# EAGLE design versao4.0 (EAGLE 7.7.0)
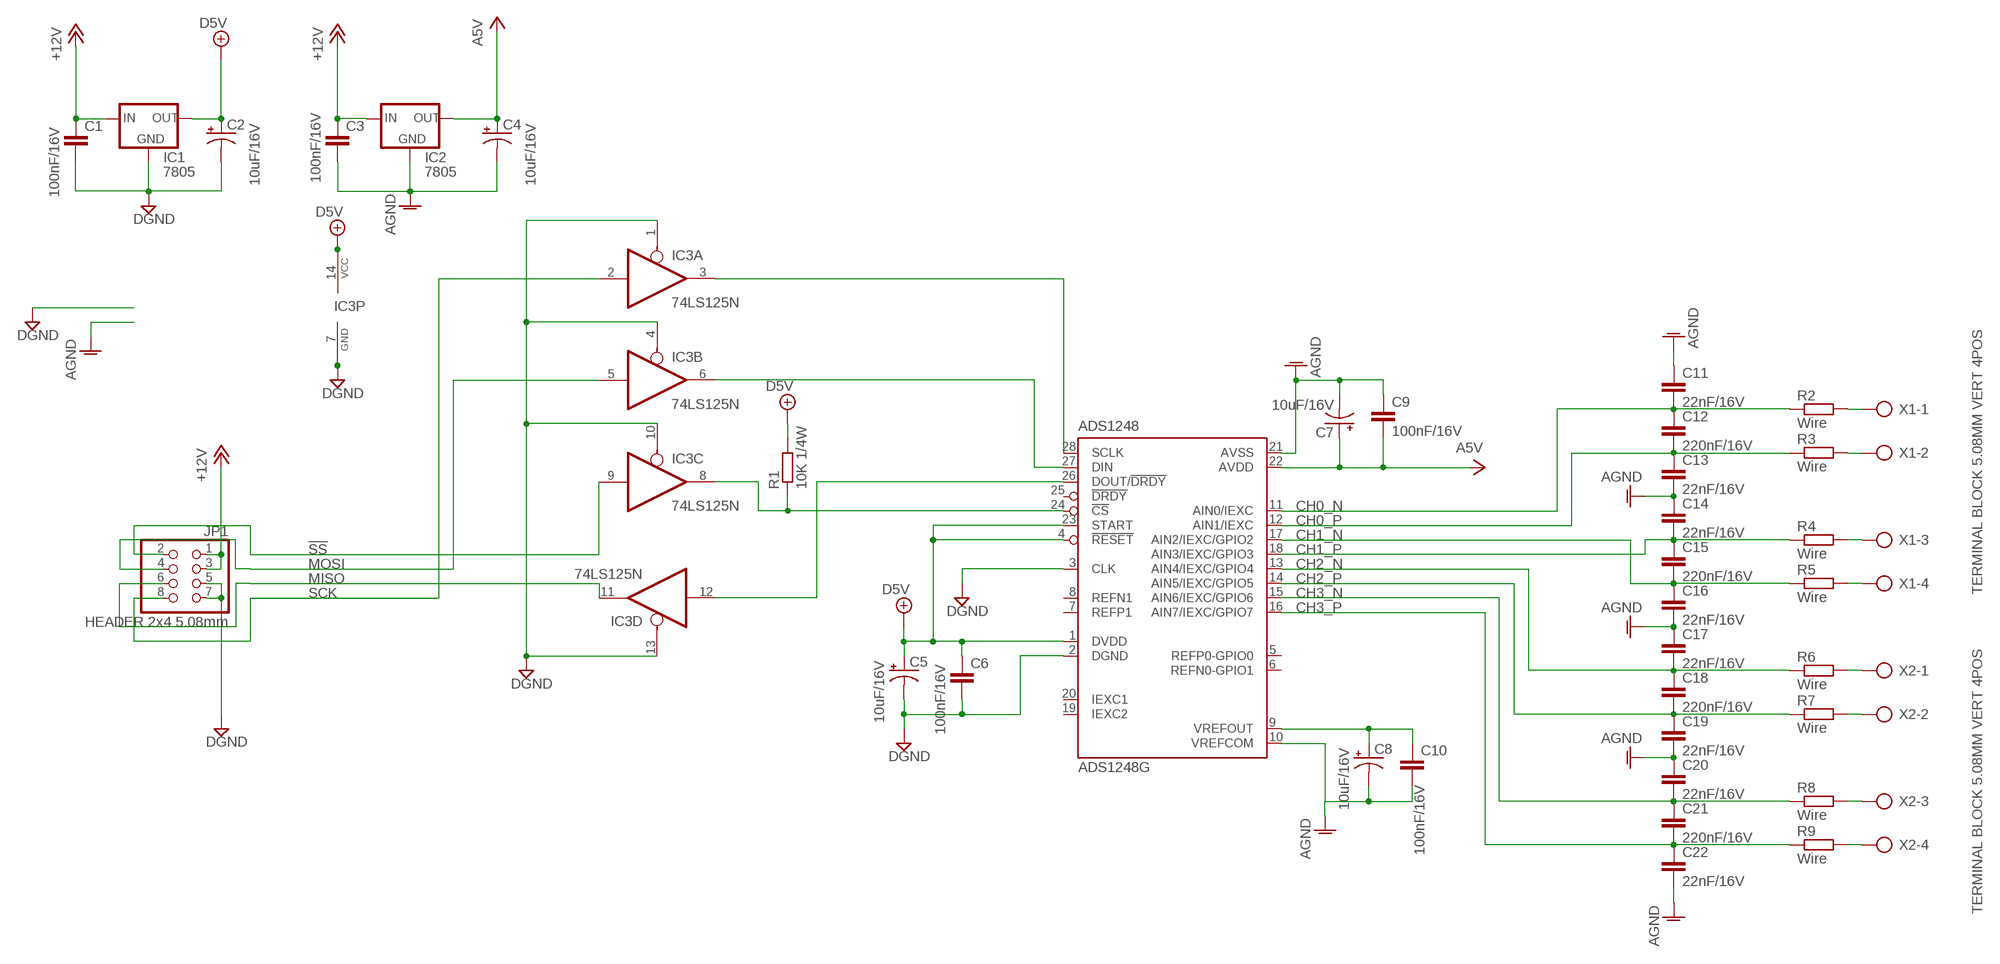
[diagram p0: schematic, sheet 1]

## Parts
C1  100nF/16V  C5/3  [C5B3]
C2  10uF/16V  CPOL-USE2-5  [E2-5]
C3  100nF/16V  C5/3  [C5B3]
C4  10uF/16V  CPOL-USE2-5  [E2-5]
C5  10uF/16V  CPOL-USE2-5  [E2-5]
C6  100nF/16V  C5/3  [C5B3]
C7  10uF/16V  CPOL-USE2-5  [E2-5]
C8  10uF/16V  CPOL-USE2-5  [E2-5]
C9  100nF/16V  C5/3  [C5B3]
C10  100nF/16V  C5/3  [C5B3]
C11  22nF/16V  C5/2.5  [C5B2.5]
C12  220nF/16V  C5/2.5  [C5B2.5]
C13  22nF/16V  C5/2.5  [C5B2.5]
C14  22nF/16V  C5/2.5  [C5B2.5]
C15  220nF/16V  C5/2.5  [C5B2.5]
C16  22nF/16V  C5/2.5  [C5B2.5]
C17  22nF/16V  C5/2.5  [C5B2.5]
C18  220nF/16V  C5/2.5  [C5B2.5]
C19  22nF/16V  C5/3  [C5B3]
C20  22nF/16V  C5/2.5  [C5B2.5]
C21  220nF/16V  C5/2.5  [C5B2.5]
C22  22nF/16V  C5/2.5  [C5B2.5]
IC1  7805  78XXL  [78XXL]
IC2  7805  78XXL  [78XXL]
IC3  74LS125N  [DIL14]
IC4  ADS1248G  [P-TSSOP28-1]
JP1  HEADER 2x4 5.08mm  PINHD-2X4  [2X04]
R1  10K 1/4W  R-EU_0204/7  [0204/7]
R2  Wire  R-EU_0204/7  [0204/7]
R3  Wire  R-EU_0204/7  [0204/7]
R4  Wire  R-EU_0204/7  [0204/7]
R5  Wire  R-EU_0204/7  [0204/7]
R6  Wire  R-EU_0204/7  [0204/7]
R7  Wire  R-EU_0204/7  [0204/7]
R8  Wire  R-EU_0204/7  [0204/7]
R9  Wire  R-EU_0204/7  [0204/7]
X1  TERMINAL BLOCK 5.08MM VERT 4POS  AK500/4-H  [AK500/4-H]
X2  TERMINAL BLOCK 5.08MM VERT 4POS  AK500/4-H  [AK500/4-H]

## Nets
!SS: IC3.9(C:I) JP1.2
+12V: C1.1 C3.1 IC1.IN IC2.IN JP1.1 JP1.3
A5V: C4.+ C7.+ C9.2 IC2.OUT IC4.22(AVDD)
AGND: C3.2 C4.- C7.- C8.- C9.1 C10.2 C11.1 C13.2 C14.1 C16.2 C17.1 C19.2 C20.1 C22.2 IC2.GND IC4.10(VREFCOM) IC4.21(AVSS)
CH0_N: C11.2 C12.1 IC4.11(AIN0/IEXC) R2.1
CH0_P: C12.2 C13.1 IC4.12(AIN1/IEXC) R3.1
CH1_N: C15.2 C16.1 IC4.17(AIN2/IEXC/GPIO2) R5.1
CH1_P: C14.2 C15.1 IC4.18(AIN3/IEXC/GPIO3) R4.1
CH2_N: C17.2 C18.1 IC4.13(AIN4/IEXC/GPIO4) R6.1
CH2_P: C18.2 C19.1 IC4.14(AIN5/IEXC/GPIO5) R7.1
CH3_N: C20.2 C21.1 IC4.15(AIN6/IEXC/GPIO6) R8.1
CH3_P: C21.2 C22.1 IC4.16(AIN7/IEXC/GPIO7) R9.1
D5V: C2.+ C5.+ C6.1 IC1.OUT IC3.14(P:VCC) IC4.1(DVDD) IC4.4(!RESET) IC4.23(START) R1.2
DGND: C1.2 C2.- C5.- C6.2 IC1.GND IC3.1(A:OE) IC3.4(B:OE) IC3.7(P:GND) IC3.10(C:OE) IC3.13(D:OE) IC4.2(DGND) IC4.3(CLK) JP1.5 JP1.7
MISO: IC3.11(D:O) JP1.6
MOSI: IC3.5(B:I) JP1.4
N$1: C8.+ C10.1 IC4.9(VREFOUT)
N$4: R3.2 X1.2
N$5: IC3.3(A:O) IC4.28(SCLK)
N$6: R9.2 X2.4
N$11: IC3.6(B:O) IC4.27(DIN)
N$12: IC3.12(D:I) IC4.26(DOUT/!DRDY)
N$13: IC3.8(C:O) IC4.24(!CS) R1.1
N$15: R2.2 X1.1
N$16: R8.2 X2.3
N$17: R7.2 X2.2
N$18: R6.2 X2.1
N$19: R5.2 X1.4
N$20: R4.2 X1.3
SCK: IC3.2(A:I) JP1.8
Unconnected: IC4.5(REFP0-GPIO0) IC4.6(REFN0-GPIO1) IC4.7(REFP1) IC4.8(REFN1) IC4.19(IEXC2) IC4.20(IEXC1) IC4.25(!DRDY)

## Library data of the parts
C1 C3 C6 C9-C22 = capacitor-wima:C: CAPACITOR naming: grid - package width
C2 C4 C5 C7 C8 = resistor:CPOL-US: POLARIZED CAPACITOR, American symbol
IC1 IC2 = v-reg:78XXL: VOLTAGE REGULATOR
IC3 = 74xx-us:74*125: Quad bus BUFFER, 3-state
IC4 = mylib:ADS1248: Phase locked loop (PLL), with a multistandard video modulator and a programmable sound FM and AM modulator
JP1 = pinhead:PINHD-2X4: PIN HEADER
R1-R9 = resistor:R-EU_: RESISTOR, European symbol
X1 X2 = con-ptr500:AK500/4-H: CONNECTOR Aug. 2004 / PTR Meßtechnik: Die Bezeichnung der Serie AK505 wurde geändert. Es handelt sich hierbei um AK500 in horizontaler Ausführung.; OC_FARNELL: unknown; OC_NEWARK: unknown

## Board
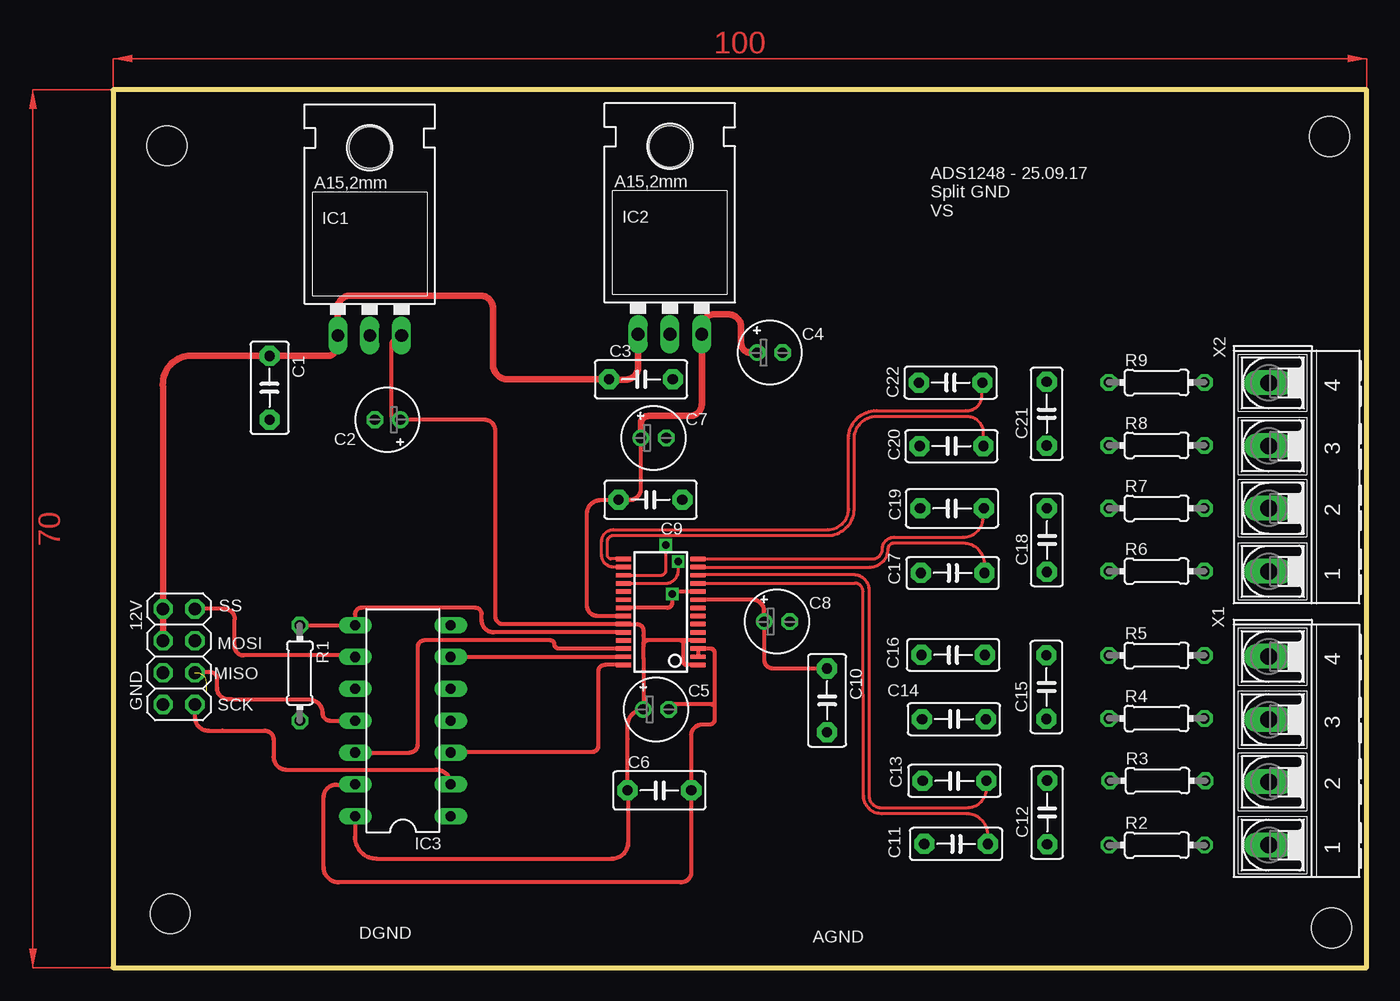
[diagram p1: board, top side]
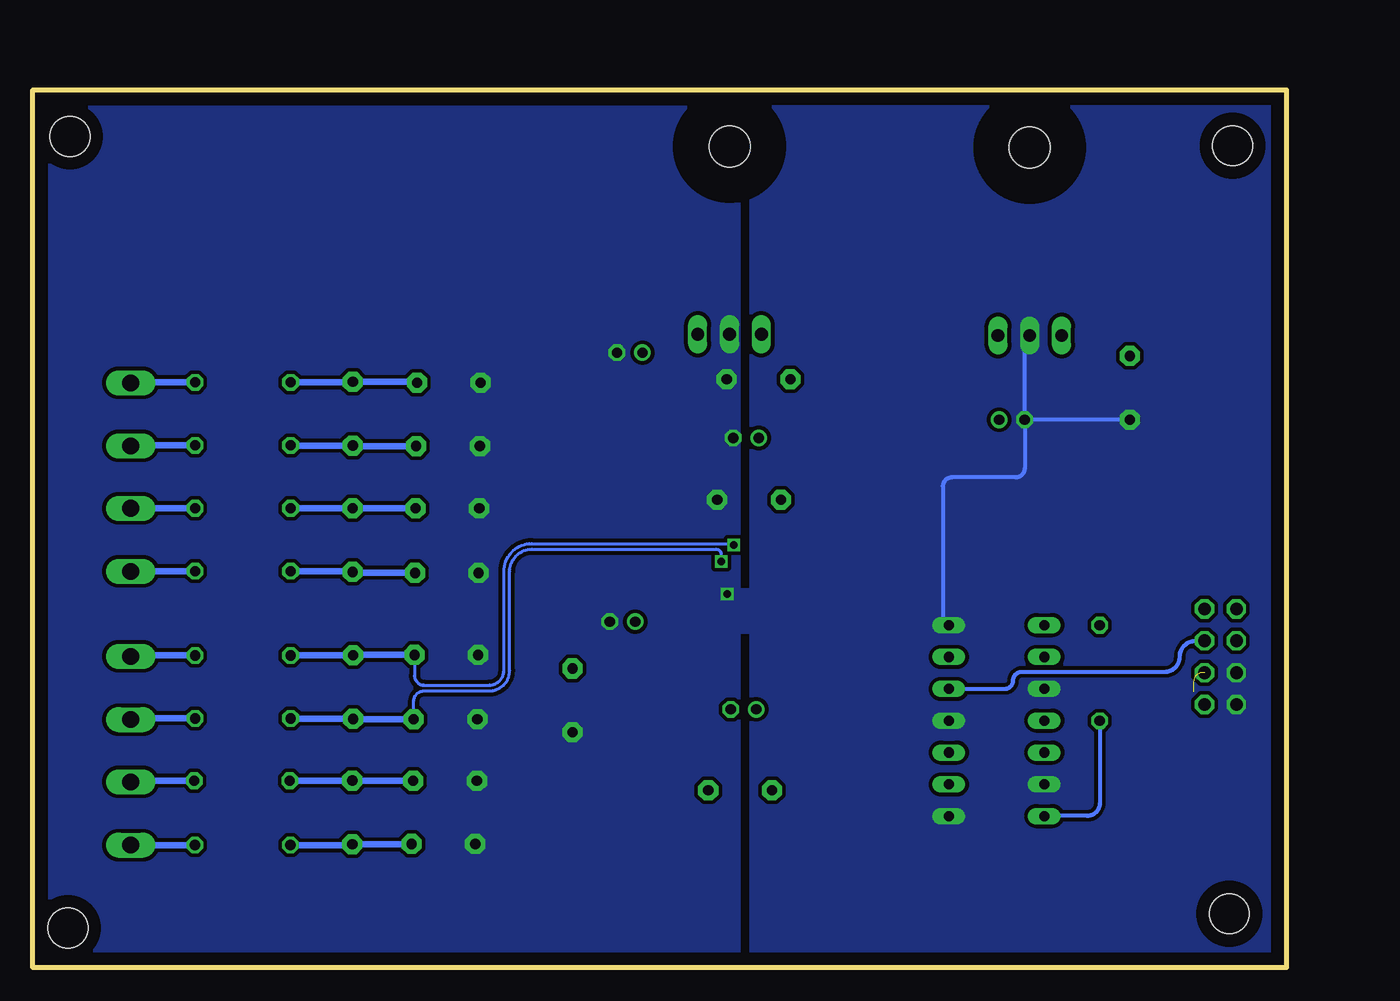
[diagram p2: board, bottom side, seen from below]

Size 100 x 70 mm. Coordinates in mm from the lower left corner, seen from the top.
Outline: 0,0 100,0 100,70 0,70 0,0
Copper layers (1*16): Top 0.035mm / dielectric 1.5mm / Bottom 0.035mm
Design rules "default": minimum track width 10mil, minimum drill 24mil, track to track 8mil, track to pad 8mil, pad to pad 8mil, via to via 8mil, smd to smd 8mil, copper to edge 40mil, drill to drill 8mil, minimum pad ring 10mil, minimum via ring 8mil, stop-mask expansion 4mil, vias tented up to drill 0mil, thermal gap 10mil
Holes 3.2 mm at 97.05,66.3 4.55,4.3 4.3,65.55 97.2,3.15

### Footprints (pad centres in the part's own frame; a part is rotated, then mirrored left to right if it is on the bottom)
C5B3 = drill 0.813 pad 1.6 octagon: 1 -2.54,0; 2 2.54,0
E2-5 = drill 0.813 pad 1.27: + -1.016,0 | drill 0.813 pad 1.27 octagon: - 1.016,0
C5B2.5 = drill 0.813 pad 1.6 octagon: 1 -2.54,0; 2 2.54,0
78XXL = drill 1.016 long: GND 0,-3.81; IN -2.54,-3.81; OUT 2.54,-3.81 | hole 3.302: 0,11.176
DIL14 = drill 0.813 long: 1 -7.62,-3.81; 2 -5.08,-3.81; 3 -2.54,-3.81; 4 0,-3.81; 5 2.54,-3.81; 6 5.08,-3.81; 7 7.62,-3.81; 8 7.62,3.81; 9 5.08,3.81; 10 2.54,3.81; 11 0,3.81; 12 -2.54,3.81; 13 -5.08,3.81; 14 -7.62,3.81
P-TSSOP28-1 = smd 0.35 x 1.2: 1 -4.225,-2.975; 2 -3.575,-2.975; 3 -2.925,-2.975; 4 -2.275,-2.975; 5 -1.625,-2.975; 6 -0.975,-2.975; 7 -0.325,-2.975; 8 0.325,-2.975; 9 0.975,-2.975; 10 1.625,-2.975; 11 2.275,-2.975; 12 2.925,-2.975; 13 3.575,-2.975; 14 4.225,-2.975; 15 4.225,2.975; 16 3.575,2.975; 17 2.925,2.975; 18 2.275,2.975; 19 1.625,2.975; 20 0.975,2.975; 21 0.325,2.975; 22 -0.325,2.975; 23 -0.975,2.975; 24 -1.625,2.975; 25 -2.275,2.975; 26 -2.925,2.975; 27 -3.575,2.975; 28 -4.225,2.975
2X04 = drill 1.016 octagon: 1 -3.81,-1.27; 2 -3.81,1.27; 3 -1.27,-1.27; 4 -1.27,1.27; 5 1.27,-1.27; 6 1.27,1.27; 7 3.81,-1.27; 8 3.81,1.27
0204/7 = drill 0.813 octagon: 1 -3.81,0; 2 3.81,0
AK500/4-H = drill 1.321 long: 1 -7.518,0; 2 -2.489,0; 3 2.489,0; 4 7.518,0

### Placement (x,y rotation side)
C1  12.48,46.25 270 top
C2  21.89,43.7 180 top
C3  42.11,46.93 0 top
C4  52.39,49.05 0 top
C5  43.31,20.6 0 top
C6  43.58,14.14 0 top
C7  43.11,42.25 0 top
C8  52.96,27.6 0 top
C9  42.87,37.32 180 top
C10  56.96,21.32 270 top
C11  67.25,9.87 0 top
C12  74.52,12.38 90 top
C13  67.12,14.9 180 top
C14  67.08,19.82 0 top
C15  74.46,22.38 90 top
C16  67.02,24.94 180 top
C17  66.98,31.48 0 top
C18  74.5,34.1 90 top
C19  66.93,36.63 180 top
C20  66.88,41.6 0 top
C21  74.48,44.18 90 top
C22  66.82,46.66 180 top
IC1  20.47,54.23 0 top
IC2  44.42,54.33 0 top
IC3  23.12,19.7 90 top
IC4  43.69,28.37 90 top
JP1  5.25,24.8 270 top
R1  14.89,23.5 270 top
R2  83.27,9.78 0 top
R3  83.32,14.91 0 top
R4  83.25,19.88 0 top
R5  83.25,24.9 0 top
R6  83.25,31.62 0 top
R7  83.25,36.64 0 top
R8  83.25,41.66 0 top
R9  83.25,46.68 0 top
X1  92.2,17.3 90 top
X2  92.2,39.13 90 top

### Tracks (layer width: path | path; a pad name or v marks a point on that pad's centre or on a via)
!SS
  Top 0.305: IC3.9 arc90 19.19,24.9 10.4,24.9 arc-90 9.7,25.6 9.7,27.8 arc90 8.89,28.61 JP1.2
+12V
  Top 0.5: IC2.IN 41.88,47.88 arc-90 40.9,46.9 39.6,46.9 arc-90 C3.1 31.47,46.93 arc-90 30.3,48.1 30.3,52.6 arc90 29.3,53.6 18.9,53.6 arc90 17.9,52.6 17.9,50.45 arc90 IC1.IN arc90 17.9,50.39 17.9,49.6 arc-90 17.09,48.79 C1.1 arc90 C1.1 6,48.8 arc90 3.98,46.28 JP1.1 JP1.3
A5V
  Top 0.305: IC4.22 38.66,28.05 arc-90 37.8,28.9 37.8,36.2 arc-90 38.9,37.3 40.31,37.3 arc90 C9.2 arc90 40.35,37.3 41.2,37.3 | 41.5,37.3 41.2,37.3 | C7.+ 42.09,38.19 arc-90 41.2,37.3
  Top 0.5: C4.+ 50.85,49.05 arc-90 50.1,49.8 50.1,51.1 arc90 49.1,52.1 47.9,52.1 arc90 46.96,51.16 IC2.OUT 46.96,44.96 arc-90 46,44 43.3,44 42.7,44 arc90 42.1,43.4 C7.+ arc-90 C7.+
AGND  (via drill 0.6)
  Top 0.305: IC4.10 arc-90 IC4.10 44.8,30 arc90 v44.6,29.8 44.6,29.1 arc-90 44.2,28.7 IC4.21 arc90 IC4.21
  pour Bottom (isolate 0.305, no thermals): 43.7,69.2 43.7,0.7 arc90 43.9,0.5 99.6,0.5 99.6,69.1 arc90 99.5,69.2
CH0_N
  Top 0.254: C11.2 69.79,10.58 arc90 68.1,12.27 61.3,12.27 arc-90 59.87,13.7 59.82,30 arc90 59.15,30.67 arc-90 59.17,30.64 IC4.11
  Bottom 0.5: R2.1 74.58,9.78 arc-90 C12.1 69.82,9.84 arc-90 C11.2
CH0_P
  Top 0.254: C13.1 69.66,14.29 arc-90 68.1,12.73 61.3,12.73 arc-90 60.33,13.7 60.33,30 arc90 59.2,31.33 46.83,31.33 arc-90 IC4.12
  Bottom 0.5: C13.1 74.5,14.9 arc90 C12.2 R3.1 arc-90 R3.1
CH1_N  (via drill 0.6)
  Top 0.254: IC4.17 43.7,31.3 arc90 44.1,31.7 v44.1,33.7
  Bottom 0.254: C16.1 69.56,23.29 arc-90 68.8,22.53 63.6,22.53 arc-90 62.43,23.7 62.43,31.6 arc90 60.2,33.83 44.23,33.83 arc90 v44.1,33.7 | 79.42,24.92 arc90 R5.1
  Bottom 0.5: 79.42,24.92 C15.2 arc90 74.44,24.94 C16.1
CH1_P  (via drill 0.6)
  Top 0.254: IC4.18 44.05,30.64 arc90 45.1,31.7 v45.1,32.4
  Bottom 0.254: C14.2 69.62,21.25 arc90 68.8,22.07 63.6,22.07 arc-90 61.97,23.7 61.97,31.6 arc90 60.2,33.37 45.47,33.37 arc90 45.1,33 v45.1,32.4 | R4.1 arc-90 79.4,19.84
  Bottom 0.5: 79.4,19.84 C15.1 arc-90 74.44,19.82 C14.2
CH2_N
  Top 0.254: IC4.13 60.37,31.95 arc90 61.83,33.4 arc-90 62.3,33.87 67.8,33.87 67.83,33.87 arc-90 69.5,32.2 69.5,31.5 arc90 C17.2
  Bottom 0.5: R6.1 74.56,31.62 arc90 C18.1 arc-90 74.42,31.48 C17.2
CH2_P
  Top 0.254: IC4.14 60.57,32.59 arc90 61.37,33.4 arc-90 62.3,34.33 67.8,34.33 67.83,34.33 arc90 69.4,35.9 69.4,36.56 arc-90 C19.1
  Bottom 0.5: R7.1 C18.2 arc-90 C18.2 C19.1
CH3_N
  Top 0.254: IC4.15 39.73,32.59 arc-90 39.43,32.9 39.43,34 arc-90 39.9,34.47 57,34.47 arc90 59.13,36.6 59.13,42.2 arc-90 60.9,43.97 68,43.97 68.13,43.97 arc-90 69.4,42.7 69.4,41.62 arc90 C20.2
  Bottom 0.5: C20.2 74.44,41.6 arc90 C21.1 79.42,41.64 arc90 R8.1
CH3_P
  Top 0.254: IC4.16 39.93,31.95 arc-90 38.97,32.9 38.97,34 arc-90 39.9,34.93 57,34.93 arc90 58.67,36.6 58.67,42.2 arc-90 60.9,44.43 68,44.43 68.13,44.43 arc90 69.3,45.6 69.3,46.6 arc-90 C22.1
  Bottom 0.5: R9.1 74.52,46.68 arc-90 C21.2 69.42,46.72 arc90 C22.1
D5V  (via drill 0.61)
  Top 0.254: 42.8,26.1 42.7,26.1 arc-90 42.3,26.5 | 42.9,26.1 42.8,26.1 | 42.8,26.1 arc90 42.3,25.6 | 45.5,25.7 45.5,25.8 arc-90 45.8,26.1 | 45.5,25.7 45.5,25.6 45.5,25.7 | 45.5,25.7 arc90 45.1,26.1 | 45.5,25.7 arc-90 45.9,26.1
  Top 0.305: IC1.OUT arc90 22.2,49.61 22.2,44 arc90 22.5,43.7 C2.+ 29.6,43.7 arc-90 30.5,42.8 30.5,28 arc90 31.11,27.39 IC4.23 41.8,27.39 arc-90 42.3,26.9 42.3,26.5 42.3,25.8 | 42.3,25.8 42.3,25.6 42.3,24.7 C5.+ arc-90 C5.+ arc90 41.04,19.3 41.04,18.24 C6.1 arc-90 41.1,14.08 41.1,10 arc-90 39.8,8.7 21,8.7 arc-90 19.29,10.41 v19.29,12.1 | IC4.4 45.6,26.09 | 45.6,26.09 42.59,26.09 arc90 42.3,25.8 | IC4.1 45.76,24.14 arc-90 45.5,24.4 45.5,25.6 45.5,25.7 45.5,26 arc-90 45.6,26.09
  Bottom 0.305: R1.2 14.89,13.11 arc90 15.9,12.1 v19.29,12.1 arc-90 IC3.14
DGND
  Top 0.254: 47.5,21 47.6,21 | 47.6,21 arc-90 48,20.6 | 47.6,21 arc90 48,21.4
  Top 0.305: IC4.2 IC4.3 arc-90 IC4.3 47.65,25.45 arc-90 48,25.1 48,21.4 48,21.2 | 48,21.2 48,20.6 48,19.8 arc-90 47.6,19.4 47,19.4 arc90 46.12,18.52 C6.2 46.12,7.62 arc-90 45.3,6.8 18,6.8 arc-90 16.8,8 16.8,13.6 arc-90 17.8,14.6 19.29,14.6 arc90 IC3.13 | 48,21.2 arc-90 47.78,20.98 arc90 47.75,21 45.8,21 44.78,21 arc90 C5.-
  Bottom 0.305: C2.- 20.87,39.83 arc90 21.6,39.1 26.7,39.1 arc-90 27.4,38.4 27.4,27.79 arc-90 IC3.7 | C2.- 20.87,50.02 arc90 IC1.GND | C1.2 C2.- arc-90 C2.-
  pour Bottom (isolate 0.305, no thermals): 0.2,69.5 42.7,69.3 42.7,0.4 0.4,0.6
MISO  (3 unrouted)
  Top 0.305: IC3.11 17.3,19.7 arc-90 16.7,20.3 arc90 15.6,21.4 9.5,21.4 9.2,21.4 arc-90 8.3,22.3 8.3,23.05 arc90 7.8,23.55 6.54,23.55 arc90 JP1.6
MOSI
  Bottom 0.305: IC3.5 22.46,22.24 arc-90 21.8,22.9 arc90 21.1,23.6 9.9,23.6 9.7,23.6 arc-90 8.5,24.8 arc90 7.23,26.07 JP1.4
N$1
  Top 0.305: C10.1 52.64,23.86 arc-90 51.95,24.55 C8.+ arc90 C8.+ 51.94,28.41 arc90 51,29.35 IC4.9 arc90 IC4.9
N$2
  pour Bottom (no thermals): 42.7,30.2 42.7,26.7 43.7,26.7 43.7,30.2
N$4
  Bottom 0.5: R3.2 92.1,14.91 arc-90 X1.2
N$5
  Top 0.305: IC4.28 39.24,24.14 arc90 38.7,23.6 38.7,17.7 arc-90 38.2,17.2 26.97,17.2 arc90 IC3.3
N$6
  Bottom 0.5: R9.2 92.17,46.68 arc-90 X2.4
N$11
  Top 0.305: IC3.6 40.7,24.78 arc90 IC4.27
N$12
  Top 0.305: IC3.12 23.66,17.16 arc90 24.3,17.8 24.3,25.6 arc-90 24.8,26.1 34.9,26.1 arc-90 35.2,25.8 arc90 35.55,25.45 IC4.26
N$13
  Top 0.305: R1.1 IC3.8 arc90 IC3.8 arc-90 IC3.8 19.3,28.2 arc-90 19.8,28.7 28.9,28.7 arc-90 29.4,28.2 29.4,27.7 arc90 30.36,26.75 IC4.24
N$15
  Bottom 0.5: R2.2 X1.1 arc90 X1.1
N$16
  Bottom 0.5: R8.2 92.16,41.66 arc-90 X2.3
N$17
  Bottom 0.5: R7.2 X2.2 arc90 X2.2
N$18
  Bottom 0.5: R6.2 X2.1 arc-90 X2.1
N$19
  Bottom 0.5: R5.2 92.12,24.9 arc-90 X1.4
N$20
  Bottom 0.5: R4.2 92.11,19.88 arc-90 X1.3
SCK
  Top 0.305: IC3.2 arc90 25.75,15.8 13.8,15.8 arc-90 12.8,16.8 12.8,18.2 arc90 12.1,18.9 8.7,18.9 7.6,18.9 arc-90 6.52,19.98 JP1.8
(copper drawn outside any net)
  shapes: Top area x2

### Text on the board
tNames: ADS1248 - 25.09.17 / Split GND / VS | 12V | SS | MOSI | GND | MISO | SCK | DGND | AGND